# EAGLE design ESP32-Programmer (EAGLE 9.6.2)
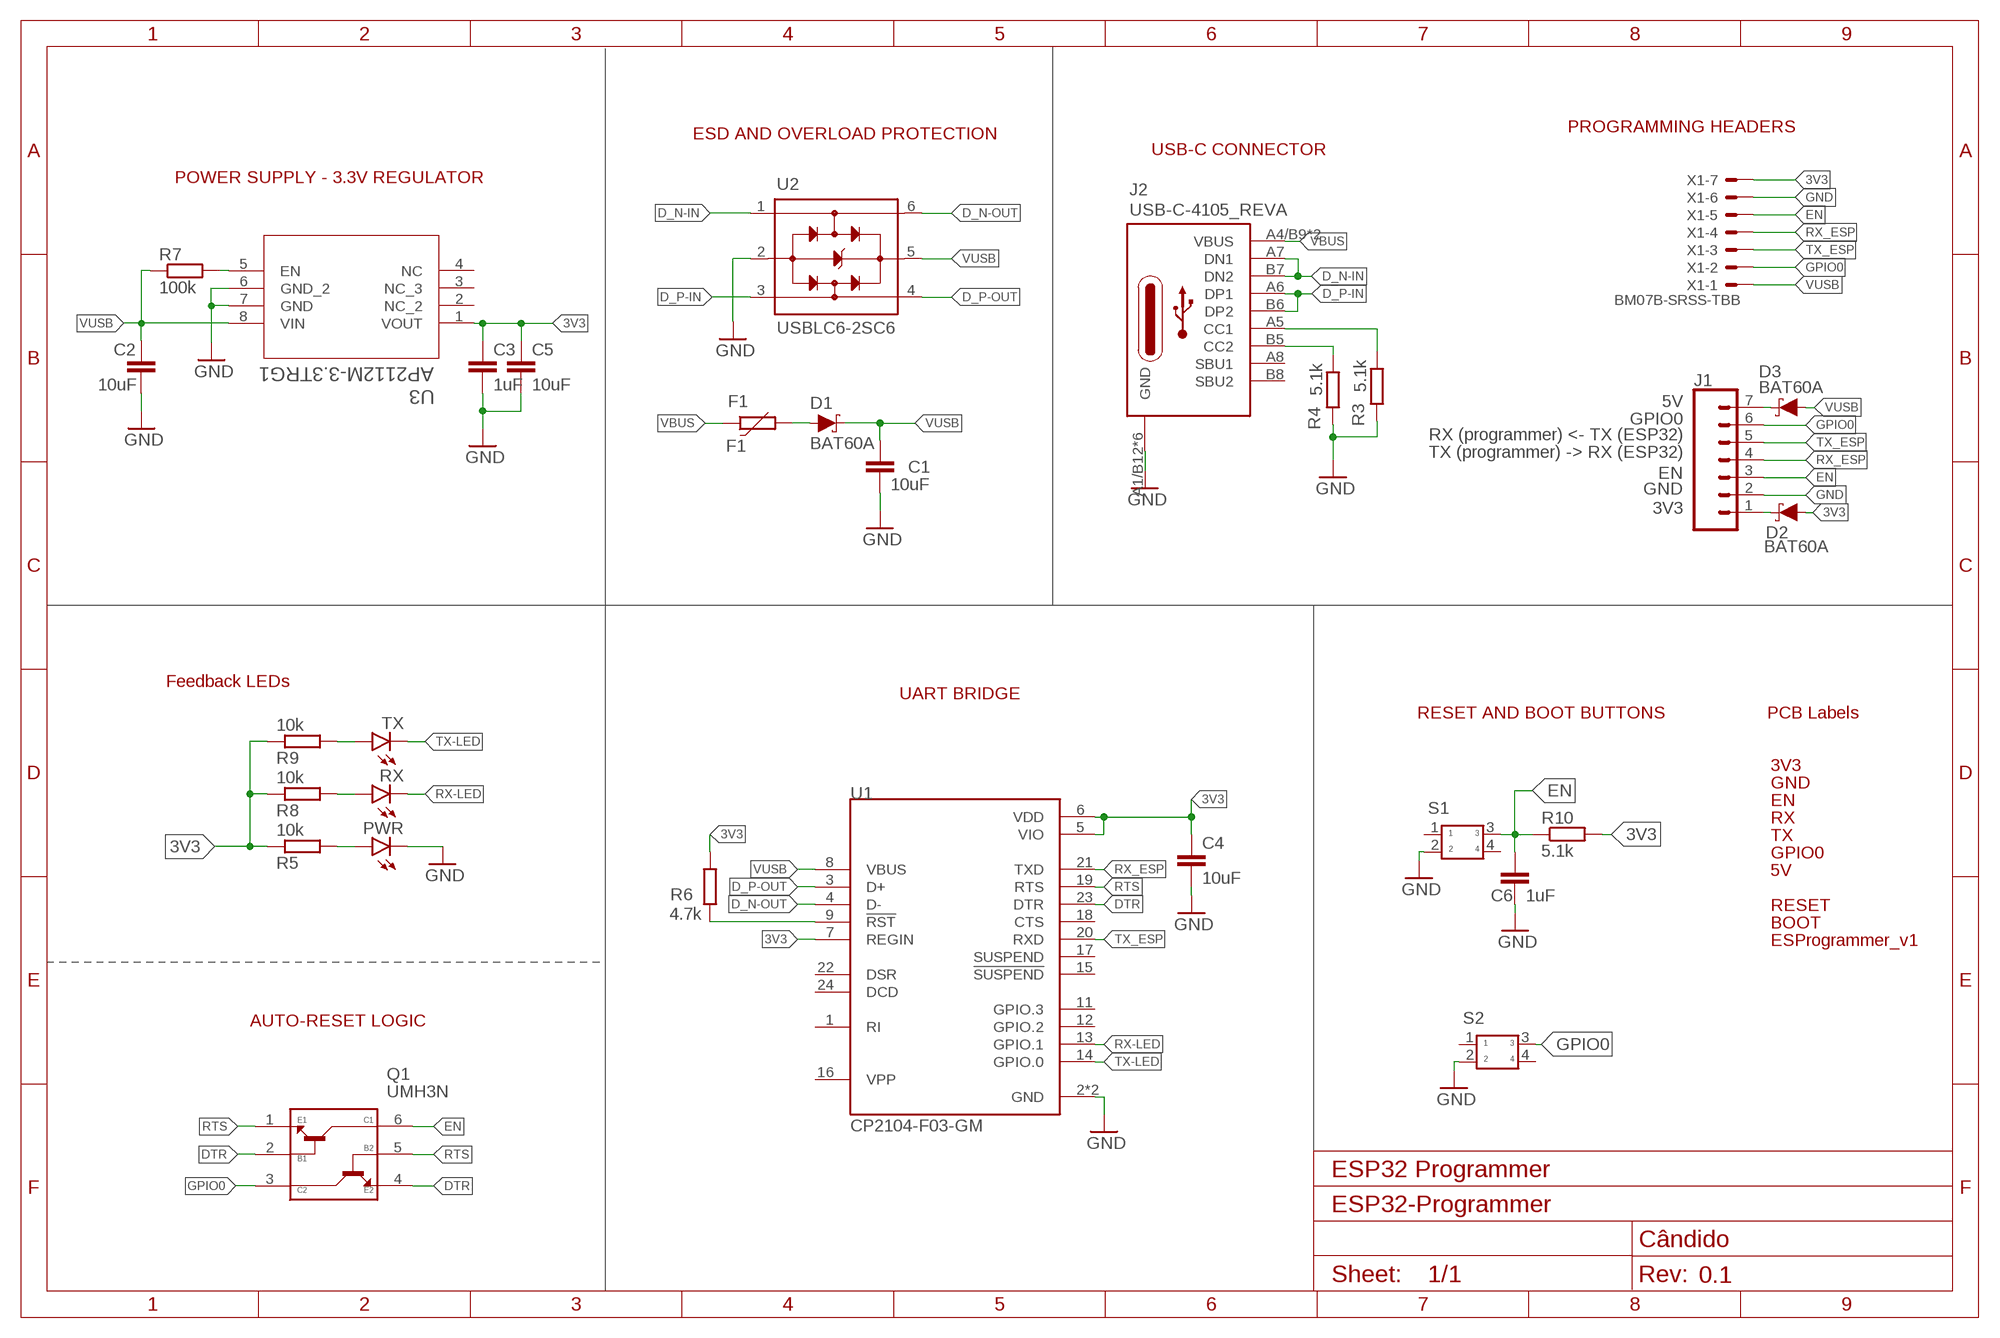
[diagram p0: schematic, sheet 1]

## Parts
C1  10uF  CAPACITOR0603-CAP  [0603-CAP]
C2  10uF  CAPACITOR0603-CAP  [0603-CAP]
C3  1uF  CAPACITOR0603-CAP  [0603-CAP]
C4  10uF  C-EUC0805  [C0805]
C5  10uF  CAPACITOR0603-CAP  [0603-CAP]
C6  1uF  C-EUC0805  [C0805]
D1  BAT60A  DIODE-SCHOTTKY-BAT60A  [SOD-323]
D2  BAT60A  DIODE-SCHOTTKY-BAT60A  [SOD-323]
D3  BAT60A  DIODE-SCHOTTKY-BAT60A  [SOD-323]
F1  F1  PTC-FUSE  [PTC1206]
FRAME1  FRAME_A4  [FRAME-A4]
J1  CONN-07NO_SILK  [1X07_NO_SILK]
J2  USB-C-4105_REVA  [GCT_USB4105_REVA]
PWR  LEDRED-0805  [LED_0805_RED]
Q1  UMH3N  [SOT65P230X110-6N]
R3  5.1k  RESISTOR-EUR0805  [R0805]
R4  5.1k  RESISTOR-EUR0805  [R0805]
R5  10k  RESISTOR-EUR0805  [R0805]
R6  4.7k  RESISTOR-EUR0805  [R0805]
R7  100k  RESISTOR-EUR0805  [R0805]
R8  10k  RESISTOR-EUR0805  [R0805]
R9  10k  RESISTOR-EUR0805  [R0805]
R10  5.1k  RESISTOR-EUR0805  [R0805]
RX  LEDYELLOW-0805  [LED_0805_YELLOW]
S1  KMR621NG_LFS  [KMR621NG_LFS]
S2  KMR621NG_LFS  [KMR621NG_LFS]
TX  LEDORANGE-0805  [LED_0805_ORANGE]
U1  CP2104-F03-GM  [QFN50P400X400X80-25N]
U2  USBLC6-2SC6  [SOT95P280X145-6N]
U3  AP2112M-3.3TRG1  [AP2112M-3.3TRG1_DIO]
U$1  BOOT0  [BOOT0]
U$2  GND0  [GND0]
U$3  3V30  [3V30]
U$4  5V0  [5V0]
U$5  EN0  [EN0]
U$6  GPIO00  [GPIO00]
U$7  RX0  [RX0]
U$8  TX0  [TX0]
U$9  RESET0  [RESET0]
U$12  ESPROGRAMMER_V10  [ESPROGRAMMER_V10]
X1  BM07B-SRSS-TBB  [BM07B-SRSS-TB]

## Nets
3V3: C3.1 C4.1 C5.1 D2.A R5.1 R6.2 R8.1 R9.1 R10.2 U1.5(VIO) U1.6(VDD) U1.7(REGIN) U3.1(VOUT) X1.7
CC1: J2.A5(CC1) R3.1
CC2: J2.B5(CC2) R4.1
D_N-IN: J2.A7(DN1) J2.B7(DN2) U2.1(I/O1_IN)
D_N-OUT: U1.4(D-) U2.6(I/O1_OUT)
D_P-IN: J2.A6(DP1) J2.B6(DP2) U2.3(I/O2_IN)
D_P-OUT: U1.3(D+) U2.4(I/O2_OUT)
DTR: Q1.2(B1) Q1.4(E2) U1.23(DTR)
EN: C6.1 J1.3 Q1.6(C1) R10.1 S1.3 X1.5
GND: C1.2 C2.2 C3.2 C4.2 C5.2 C6.2 J1.2 J2.A1/B12(GND) J2.B1/A12(GND) J2.G1(GND) J2.G2(GND) J2.G3(GND) J2.G4(GND) PWR.C R3.2 R4.2 S1.2 S2.2 U1.2(GND) U1.25(GND) U2.2(GND) U3.6(GND_2) U3.7(GND) X1.6
GPIO0: J1.6 Q1.3(C2) S2.3 X1.2
N$3: R6.1 U1.9(!RST)
N$4: D2.C J1.1
N$5: D3.C J1.7
N$7: PWR.A R5.2
N$8: R7.2 U3.5(EN)
N$10: R8.2 RX.A
N$11: R9.2 TX.A
N$12: D1.A F1.2
RTS: Q1.1(E1) Q1.5(B2) U1.19(RTS)
RX-LED: RX.C U1.13(GPIO.1)
RX_ESP: J1.4 U1.21(TXD) X1.4
TX-LED: TX.C U1.14(GPIO.0)
TX_ESP: J1.5 U1.20(RXD) X1.3
VBUS: F1.1 J2.A4/B9(VBUS) J2.B4/A9(VBUS)
VUSB: C1.1 C2.1 D1.C D3.A R7.1 U1.8(VBUS) U2.5(VBUS) U3.8(VIN) X1.1
Unconnected: J2.A8(SBU1) J2.B8(SBU2) S1.1 S1.4 S2.1 S2.4 U1.1(RI) U1.11(GPIO.3) U1.12(GPIO.2) U1.15(!SUSPEND) U1.16(VPP) U1.17(SUSPEND) U1.18(CTS) U1.22(DSR) U1.24(DCD) U3.2(NC_2) U3.3(NC_3) U3.4(NC)

## Notes on the sheet
- PROGRAMMING HEADERS
- ESD AND OVERLOAD PROTECTION
- USB-C CONNECTOR
- POWER SUPPLY - 3.3V REGULATOR
- 5V
- GPIO0
- RX (programmer) <- TX (ESP32)
- TX (programmer) -> RX (ESP32)
- EN
- GND
- 3V3
- Feedback LEDs
- UART BRIDGE
- RESET AND BOOT BUTTONS | PCB Labels
- AUTO-RESET LOGIC

## Library data of the parts
C1-C3 C5 = Vsoft:CAPACITOR: Capacitor Standard 0603 ceramic capacitor, and 0.1" leaded capacitor.
C4 C6 = Vsoft:C-EU: CAPACITOR, European symbol
D1-D3 = SparkFun-DiscreteSemi:DIODE-SCHOTTKY: Schottky diode A Schottky diode is a semiconductor diode which has a low forward voltage drop and a very fast switching action.; PROD_ID: DIO-14072; VALUE: 3A/10V/280mV
F1 = kailh_cn7:PTC-FUSE
FRAME1 = CN7:FRAME_A4: Frame sized for A4 page with 6mm margin. Places name, datecode and revision mark in bottom copper layer of PCB.; CNAME: ESP32 Programmer; CREVISION: 0.1; DESIGNER: Cândido
J1 = CN7:CONN-07: Multi connection point. Often used as Generic Header-pin footprint for 0.1 inch spaced/style header connections On any of the 0.1 inch spaced packages, you can populate with these: Break Away Headers - Straight <https://www.sparkfun.com/products/116> (PRT-00116) Break Away Male Headers - Right Angle <https://www.sparkfun.com/products/553> (PRT-00553) Female Headers <https://www.sparkfun.com/products/115> (PRT-00115) Break Away Headers - Machine Pin <https://www.sparkfun.com/products/117> (PRT-00117) Break Away Female Headers - Swiss Machine Pin <https://www.sparkfun.com/products/743> (PRT-00743) For SCREWTERMINALS and SPRING TERMINALS visit here: Screw Terimnals on SparkFun.com <https://www.sparkfun.com/search/results?term=Screw+Terminals> (5mm/3.5mm/2.54mm spacing) This device is also useful as a general connection point to wire up your design to another part of your project. Our various solder wires solder well into these plated through hole pads. Hook-Up Wire - Assortment (Stranded, 22 AWG) <https://www.sparkfun.com/products/11375> (PRT-11375) Hook-Up Wire - Assortment (Solid Core, 22 AWG) <https://www.sparkfun.com/products/11367> (PRT-11367) View the entire wire category on our website here <https://www.sparkfun.com/categories/141> Special notes: Molex polarized connector foot print use with SKU : PRT-08231 with associated crimp pins and housings. 1MM SMD Version SKU: PRT-10208 NOTES ON THE VARIANTS LOCK and LOCK_LONGPADS... This footprint was designed to help hold the alignment of a through-hole component (i.e. 6-pin header) while soldering it into place. You may notice that each hole has been shifted either up or down by 0.005 of an inch from it's more standard position (which is a perfectly straight line). This slight alteration caused the pins (the squares in the middle) to touch the edges of the holes. Because they are alternating, it causes a "brace" to hold the component in place. 0.005 has proven to be the perfect amount of "off-center" position when using our standard breakaway headers. Although looks a little odd when you look at the bare footprint, once you have a header in there, the alteration is very hard to notice. Also,if you push a header all the way into place, it is covered up entirely on the bottom side.
J2 = CN7:USB-C-4105_REVA: USB Type C Receptacle for USB 2.0 SMT Type, PCB Top Mount; DESCRIPTION: USB-C (USB TYPE-C) USB 2.0 Receptacle Connector 24 (16+8 Dummy) Position Surface Mount, Right Angle; Through Hole; DIGI-KEY_PART_NUMBER: 2073-USB4105-GF-ACT-ND; MF: Global Connector Technology; MP: USB4105; PACKAGE: Package; PURCHASE-URL: https://pricing.snapeda.com/search/part/USB4105/?ref=eda
PWR RX TX = CN7:LED: LED (Generic) Standard schematic elements and footprints for 5mm, 3mm, 1206, and 0603 sized LEDs. Generic LEDs with no color specified.
Q1 = CN7:UMH3N: 2 NPN pre-biased (Dual) 100mA 50V SC-70-6(SOT-363) Digital Transistors RoHS Source: Datasheet <https://datasheet.lcsc.com/szlcsc/Changjiang-Electronics-Tech-CJ-UMH3N_C62892.pdf> Check availability <https://pricing.snapeda.com/parts/UMH3N/Rohm/view-part?ref=eda>; AVAILABILITY: In Stock; DESCRIPTION: Pre-Biased Bipolar Transistor (BJT) 2 NPN - Pre-Biased (Dual) 50V 100mA 250MHz 150mW Surface Mount UMT6; MF: Rohm; MP: UMH3N; PACKAGE: SOT-363 Rohm; PRICE: None; PURCHASE-URL: https://pricing.snapeda.com/search/part/UMH3N/?ref=eda
R3-R10 = Vsoft:RESISTOR-EU: RESISTOR, European symbol
S1 S2 = CN7:KMR621NG_LFS: IP67 Black Button Tactile Switch, SPST-NO 50 mA 2.11mm Surface Mount Source: Datasheet <http://www.ckswitches.com/media/1907/kmr6.pdf>; ARROW_PART_NUMBER: KMR621NG LFS; DESCRIPTION: IP67 Black Button Tactile Switch, SPST-NO 50 mA 2.11mm Surface Mount; DIGIKEY: CKN10684CT-ND; MANUFACTURER: C & K COMPONENTS; MANUFACTURER_PART_NUMBER: KMR621NG LFS; RS_PART_NUMBER: 1359408
U1 = Vsoft:CP2104-F03-GM: USB-to-UART 1-CH 576byte FIFO 3.3V 24-Pin QFN EP T/R; DESCRIPTION: USB Bridge, USB to UART USB 2.0 UART Interface 24-QFN (4x4); DIGI-KEY_PART_NUMBER: 336-2008-5-ND; MF: Silicon Labs; MP: CP2104-F03-GM; PACKAGE: WFQFN-24 Silicon Labs; PURCHASE-URL: https://pricing.snapeda.com/search/part/CP2104-F03-GM/?ref=eda
U2 = CN7:USBLC6-2SC6: Check availability <https://pricing.snapeda.com/parts/USBLC6-2SC6/STMicroelectronics/view-part?ref=eda> Check availability <https://pricing.snapeda.com/parts/USBLC6-2SC6/STMicroelectronics/view-part?ref=eda>; DESCRIPTION: 17V Clamp 5A (8/20µs) Ipp Tvs Diode Surface Mount SOT-23-6; DIGI-KEY_PART_NUMBER: 497-5235-2-ND; MF: STMicroelectronics; MP: USBLC6-2SC6; PACKAGE: SOT-23-6 STMicroelectronics; PURCHASE-URL: https://pricing.snapeda.com/search/part/USBLC6-2SC6/?ref=eda
U3 = Vsoft:AP2112M-3.3TRG1; COPYRIGHT: Copyright (C) 2022 Ultra Librarian. All rights reserved.; DIGI-KEY_PART_NUMBER_1: AP2112M-3.3TRG1DITR-ND; DIGI-KEY_PART_NUMBER_2: AP2112M-3.3TRG1DICT-ND; DIGI-KEY_PART_NUMBER_3: AP2112M-3.3TRG1DIDKR-ND; MANUFACTURER_PART_NUMBER: AP2112M-3.3TRG1; MFR_NAME: Diodes Inc
U$1 = BOOT-RR:BOOT0
U$2 = gnd-sr:GND0
U$3 = 3V3-sr:3V30
U$4 = 5V-sr:5V0
U$5 = EN-sr:EN0
U$6 = GPIO0-sr:GPIO00
U$7 = RX-sr:RX0
U$8 = TX-SR:TX0
U$9 = RESET-RR:RESET0
U$12 = ESProgrammer:ESPROGRAMMER_V10
X1 = CN7:BM07B-SRSS-TB: Disconnectable Crimp style connector, 1.0mm pitch 7 contacts

## Board
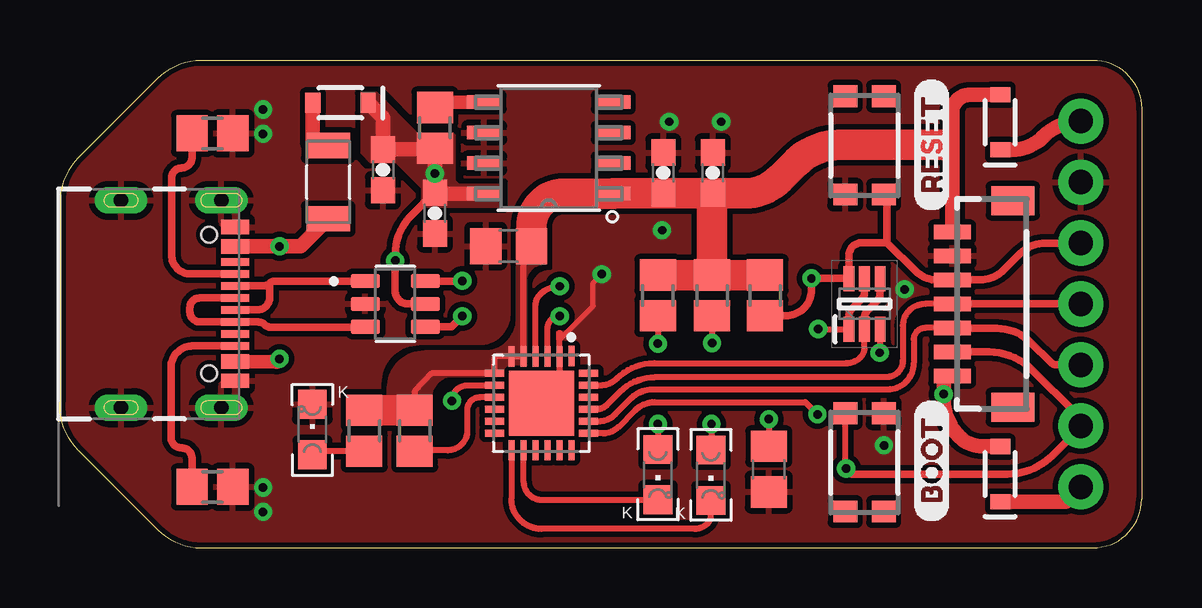
[diagram p1: board, top side]
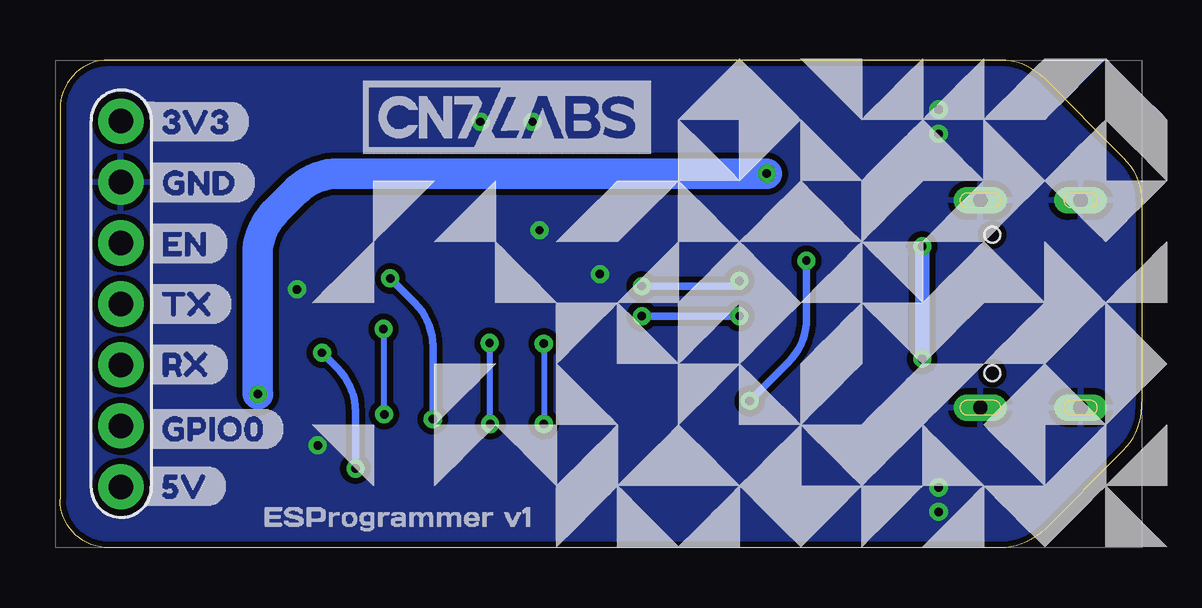
[diagram p2: board, bottom side, seen from below]

Size 45.09 x 20.33 mm. Coordinates in mm from the lower left corner, seen from the top.
Outline: 0.77,16.26 4.07,19.56 arc-49 6.1,20.33 43.06,20.33 arc-90 45.09,18.29 45.09,2.04 arc-90 43.06,0.01 6.1,0.01 arc-49 4.07,0.77 0.77,4.07 arc-49 0.01,6.1 0.01,14.23 arc-49 0.77,16.26
Copper layers (1*16): Top 0.035mm / dielectric 1.5mm / Bottom 0.035mm
Design rules "Vsoft_Hardware *": minimum track width 8mil, minimum drill 18mil, track to track 8mil, track to pad 2mil, pad to pad 2mil, via to via 2mil, smd to smd 2mil, copper to edge 1mil, drill to drill 1mil, minimum pad ring 10mil, minimum via ring 8mil, stop-mask expansion 2mil, vias tented up to drill 20mil, thermal gap 10mil

### Footprints (pad centres in the part's own frame; a part is rotated, then mirrored left to right if it is on the bottom)
0603-CAP = smd 1.1 x 1: 1 -0.85,0; 2 0.85,0
C0805 = smd 1.3 x 1.5: 1 -0.95,0; 2 0.95,0
SOD-323 = smd 0.63 x 0.83: A 1.15,0; C -1.15,0
PTC1206 = smd 1.06 x 1.82: 1 -1.528,0; 2 1.528,0
1X07_NO_SILK = drill 1.016 pad 1.88: 1 0,0; 2 2.54,0; 3 5.08,0; 4 7.62,0; 5 10.16,0; 6 12.7,0; 7 15.24,0
GCT_USB4105_REVA = smd 0.6 x 1.15: A1/B12 -3.2,4.755; A4/B9 -2.4,4.755; B1/A12 3.2,4.755; B4/A9 2.4,4.755 | smd 0.3 x 1.15: A5 -1.25,4.755; A6 -0.25,4.755; A7 0.25,4.755; A8 1.25,4.755; B5 1.75,4.755; B6 0.75,4.755; B7 -0.75,4.755; B8 -1.75,4.755 | drill 0.6 pad 1 long: G1 -4.32,0; G2 4.32,0 | drill 0.6 pad 1.05 long: G3 -4.32,4.18; G4 4.32,4.18 | hole 0.65: 2.89,3.68; -2.89,3.68
LED_0805_RED = smd 1.2 x 1.2: A 0,-1.05; C 0,1.05
SOT65P230X110-6N = smd 1.05 x 0.45: 1 -1.05,0.65; 2 -1.05,0; 3 -1.05,-0.65; 4 1.05,-0.65; 5 1.05,0; 6 1.05,0.65
R0805 = smd 1.3 x 1.5: 1 -0.85,0; 2 0.85,0
LED_0805_YELLOW = smd 1.2 x 1.2: A 0,-1.05; C 0,1.05
KMR621NG_LFS = smd 0.9 x 1: 1 -2.05,-0.8; 2 2.05,-0.8; 3 2.05,0.8; 4 -2.05,0.8
LED_0805_ORANGE = smd 1.2 x 1.2: A 0,-1.05; C 0,1.05
QFN50P400X400X80-25N = smd 0.84 x 0.26: 1 -1.97,1.25 | smd 0.82 x 0.26: 2 -1.955,0.75; 3 -1.955,0.25; 4 -1.955,-0.25; 5 -1.955,-0.75; 6 -1.955,-1.25; 13 1.955,-1.25; 14 1.955,-0.75; 15 1.955,-0.25; 16 1.955,0.25; 17 1.955,0.75; 18 1.955,1.25 | smd 0.26 x 0.82: 7 -1.25,-1.955; 8 -0.75,-1.955; 9 -0.25,-1.955; 10 0.25,-1.955; 11 0.75,-1.955; 12 1.25,-1.955; 19 1.25,1.955; 20 0.75,1.955; 21 0.25,1.955; 22 -0.25,1.955; 23 -0.75,1.955; 24 -1.25,1.955 | smd 2.7 x 2.7: 25 0,0
SOT95P280X145-6N = smd 1.21 x 0.59: 1 -1.255,0.95; 2 -1.255,0; 3 -1.255,-0.95; 4 1.255,-0.95; 5 1.255,0; 6 1.255,0.95
AP2112M-3.3TRG1_DIO = smd 1.422 x 0.559: 1 -2.692,1.905; 2 -2.692,0.635; 3 -2.692,-0.635; 4 -2.692,-1.905; 5 2.692,-1.905; 6 2.692,-0.635; 7 2.692,0.635; 8 2.692,1.905
BM07B-SRSS-TB = smd 0.6 x 1.55: 1 3,-1.625; 2 2,-1.625; 3 1,-1.625; 4 0,-1.625; 5 -1,-1.625; 6 -2,-1.625; 7 -3,-1.625 | smd 1.2 x 1.8: FIT@1 4.3,0.9; FIT@2 -4.3,0.9

### Placement (x,y rotation side)
C1  13.47,15.75 270 top
C2  15.63,13.95 270 top
C3  25.15,15.63 90 top
C4  18.7,12.58 180 top
C5  27.21,15.63 90 top
C6  29.55,3.28 270 top
D1  11.69,18.55 180 top
D2  39.2,17.73 90 top
D3  39.2,3.08 90 top
F1  11.18,15.25 90 top
FRAME1  44.96,0.26 0 top
J1  42.55,17.79 270 top
J2  2.55,10.17 270 top
PWR  10.52,4.93 0 top
Q1  33.53,10.17 90 top
R3  6.36,17.28 0 top
R4  6.36,2.55 0 top
R5  12.68,4.88 270 top
R6  14.79,4.88 90 top
R7  15.63,17.51 90 top
R8  27.18,10.52 270 top
R9  24.92,10.52 270 top
R10  29.39,10.52 90 top
RX  27.13,3.03 180 top
S1  33.53,16.77 270 top
S2  33.53,3.56 90 top
TX  24.92,3.05 180 top
U1  20.07,6.03 270 top
U2  13.98,10.17 0 top
U3  20.38,16.67 180 top
U$1  36.33,1.02 90 top
U$2  41.74,15.22 0 bottom
U$3  41.79,17.76 0 bottom
U$4  41.79,2.57 0 bottom
U$5  41.76,12.68 0 bottom
U$6  41.79,4.96 0 bottom
U$7  41.79,7.65 0 bottom
U$8  41.76,10.17 0 bottom
U$9  36.33,13.98 90 top
U$10  [CN7LABS-1]  32.49,16.41 0 bottom
U$11  [TRUCHET-TILE-1]  34.8,0.03 0 bottom
U$12  37.37,1.35 0 bottom
X1  38.82,10.17 270 top

### Tracks (layer width: path | path; a pad name or v marks a point on that pad's centre or on a via)
3V3
  Top 0.254: R6.2 14.79,6.52 15.49,7.28 U1.7 18.12,7.91 18.19,7.98 | 18.17,7.98 U1.6 U1.5 19.32,12.25 C4.1
  Top 0.61: X1.7 37.19,16.8 | 37.19,16.8 37.19,18.14 arc-90 37.93,18.89 D2.A | 36.86,16.77 37.17,16.77 37.19,16.8
  Top 1.27: 36.86,16.77 36.84,16.8 32.48,16.8 arc45 30.68,16.05 30.03,15.4 arc-45 28.53,14.78 C5.1 | R8.1 R9.1 | R10.2 R8.1 | R8.1 27.18,14.72 arc-45 C5.1 | C5.1 C3.1 23.1,14.78 arc45 U3.1 21,14.76 arc45 20.05,14.37 arc45 19.65,13.4 C4.1 | R5.1 R6.2
  pour Top (no thermals): 15.53,6.3 arc-90 16.36,7.14 18.47,7.14 arc90 18.52,7.19 18.52,7.35 arc-90 18.75,7.57 19.39,7.57 arc90 19.46,7.65 19.46,11.11 arc-90 20.17,11.82 20.22,11.82 arc90 20.3,11.89 20.3,12.63 arc90 20.15,12.78 19.03,12.78 arc90 19,12.76 19,9.53 arc-90 17.68,8.21 15.19,8.21 arc90 13.62,6.64 13.62,6.05 arc90 13.75,5.92 15.42,5.92 arc90 15.53,6.03
CC1
  Top 0.305: J2.A5 5.44,11.42 arc-90 4.65,12.2 4.65,15.42 arc-90 5.06,15.83 arc90 5.51,16.28 R3.1
CC2
  Top 0.305: J2.B5 5.52,8.42 arc90 4.63,7.52 4.63,4.6 arc90 5.06,4.17 arc-90 5.51,3.73 R4.1
D_N-IN
  Top 0.305: J2.B7 8.47,10.92 arc45 8.74,11.03 | 8.74,11.03 arc-45 8.95,11.12 U2.1 | J2.A7 8.21,9.92 arc90 8.74,10.45 8.74,11.03
D_N-OUT  (via drill 0.35)
  Top 0.254: v20.83,10.9 20.82,10.9 arc45 20.02,10.57 arc45 19.82,10.09 U1.4
  Top 0.305: U2.6 16.75,11.12 v16.77,11.13
  Bottom 0.305: v20.83,10.9 17,10.9 v16.77,11.13
D_P-IN
  Top 0.254: 5.84,10.42 5.82,10.42
  Top 0.305: J2.A6 5.84,10.42 | U2.3 12.71,9.2 8.78,9.2 arc-45 8.54,9.3 arc45 8.27,9.42 J2.B6 5.84,9.42 arc-90 5.42,9.84 5.42,10.01 arc-90 5.82,10.42
D_P-OUT  (via drill 0.35)
  Top 0.254: U1.3 20.32,9.15 arc-90 v20.83,9.66
  Top 0.305: U2.4 16.33,9.22 v16.77,9.66
  Bottom 0.305: v20.83,9.66 v16.77,9.66
DTR
  Top 0.254: U1.23 22.51,6.78 arc45 23.22,7.07 23.22,7.06 arc-45 24.76,7.7 32.77,7.7 arc45 33.38,7.96 arc45 33.53,8.32 Q1.2
  Top 0.305: Q1.2 33.53,9.58 arc-45 33.66,9.89 34.04,10.27 arc45 34.18,10.61 Q1.4
EN  (via drill 0.35)
  Top 0.254: v29.55,5.37 C6.1 | 32.87,11.23 Q1.6
  Top 0.305: 34.47,12.74 34.47,12.72 33.43,12.72 arc90 32.88,12.17 Q1.6 | 34.47,12.74 34.47,14.58 S1.3 | J1.3 41.08,12.71 arc45 40.04,12.27 39.35,11.59 arc-45 38.33,11.17 X1.5 36.56,11.17 arc-45 35.67,11.54 34.48,12.73 arc-45 34.47,12.74 | 32.87,11.23 v31.32,11.23 31.32,10.74 arc-45 31.01,9.98 arc-45 30.26,9.67 R10.1
  Bottom 0.305: v29.55,5.37 29.55,8.4 arc-45 30.29,10.2 v31.32,11.23
GND  (via drill 0.35)
  Top 0.203: 20.82,8.67 22.23,10.07 22.23,11.05 v22.59,11.41
  Top 0.254: U1.25 20.07,6.99 20.82,6.99 U1.2 20.82,8.67 20.82,8.95 20.83,8.95
  other vias: 35.21,10.78 34.35,4.27 25.39,17.76 27.56,17.76 8.46,18.27 8.46,17.25 8.46,2.52 8.46,1.5 25.1,13.24
  pour Top (isolate 0.229, rank 2): 45.45,20.71 -0.3,20.71 -0.3,-0.27 45.45,-0.27
  pour Bottom (isolate 0.254): 45.57,20.58 -0.45,20.58 -0.45,-0.43 45.57,-0.43
GPIO0  (via drill 0.35)
  Top 0.254: Q1.3 34.18,8.15 v34.17,8.13 | v32.77,3.31 32.73,3.35 S2.3
  Top 0.305: X1.2 38.72,8.17 arc-45 40.52,7.42 42.33,5.61 arc-45 J1.6 arc-45 42.51,5 41.38,3.87 arc-45 39.48,3.08 33,3.08 v32.77,3.31
  Bottom 0.305: v32.77,3.31 32.77,5.68 arc-45 33.52,7.48 v34.17,8.13
N$3
  Top 0.254: U1.9 17.5,6.28 arc90 16.97,5.75 16.97,4.88 arc-90 16.16,4.07 14.83,4.07 arc90 R6.1
N$4
  Top 0.61: D2.C 39.67,16.59 arc45 40.98,17.13 40.99,17.14 arc-45 J1.1
N$5
  Top 0.61: D3.C 41.93,1.93 J1.7
N$7
  Top 0.254: R5.2 10.64,4.03 PWR.A
N$8
  Top 0.559: U3.5 15.74,18.57 R7.2
N$10  (via drill 0.35)
  Top 0.254: R8.2 v27.18,8.54 | v27.16,5.16 27.16,4.1 RX.A
  Bottom 0.254: v27.18,8.54 27.18,5.19 v27.16,5.16
N$11  (via drill 0.35)
  Top 0.254: R9.2 v24.92,8.51 | v24.92,5.16 TX.A
  Bottom 0.254: v24.92,8.51 v24.92,5.16
N$12
  Top 0.61: F1.2 10.67,16.77 10.54,16.91 D1.A
RTS  (via drill 0.35)
  Top 0.254: v31.58,5.57 31.07,6.08 24.8,6.08 arc45 23.97,5.74 23.27,5.04 arc-45 22.65,4.78 U1.19 | v31.6,9.12 v31.61,9.12 Q1.1
  Top 0.305: Q1.1 32.88,9.67 arc-45 33.01,9.97 33.44,10.4 arc45 33.53,10.63 Q1.5
  Bottom 0.254: v31.58,5.57 31.58,9.12 v31.6,9.12
RX-LED
  Top 0.254: U1.13 18.82,2.04 arc90 20.07,0.79 26.45,0.79 arc45 26.99,1.02 arc45 27.13,1.35 RX.C
RX_ESP
  Top 0.254: X1.4 36.07,10.17 arc45 35.39,9.88 arc45 35.13,9.27 35.13,7.8 arc-90 34.45,7.12 24.8,7.12 arc45 23.36,6.52 22.83,5.99 arc-45 22.32,5.78 U1.21
  Top 0.305: J1.4 X1.4
TX-LED
  Top 0.254: U1.14 19.32,2.77 arc90 20.09,2 TX.C
TX_ESP
  Top 0.254: X1.3 36.06,9.17 arc90 35.59,8.69 35.59,7.69 arc-90 34.51,6.61 24.69,6.61 arc45 23.83,6.25 23.14,5.57 arc-45 22.44,5.28 U1.20
  Top 0.305: J1.5 41.55,7.63 arc-45 41.31,7.73 40.48,8.56 arc45 39.05,9.15 37.23,9.15 arc-45 X1.3
VBUS  (via drill 0.35)
  Top 0.559: J2.B4/A9 9.04,7.77
  Top 0.61: J2.A4/B9 v9.15,12.57 10.03,12.57 F1.1 | 9.04,7.77 v9.15,7.88
  Bottom 0.61: v9.15,7.88 v9.15,12.57
VUSB  (via drill 0.35)
  Top 0.254: v16.34,6.13 arc-90 16.99,6.78 U1.8
  Top 0.305: 15.63,14.79 C2.1 15.58,14.8 14.67,13.89 arc45 13.98,12.22 v13.98,11.97 13.98,10.7 arc90 14.51,10.17 U2.5
  Top 0.61: D1.C 13.47,17.92 C1.1 15.58,16.6 R7.1 v15.63,15.6 C2.1 15.66,14.76 U3.8 | X1.1 36.84,7.17 v36.84,6.41 36.84,6.22 arc45 37.5,4.63 arc45 38.46,4.23 D3.A
  Bottom 0.305: v13.98,11.97 13.98,9.54 arc45 14.72,7.75 v16.34,6.13
  Bottom 1.27: v36.84,6.41 36.86,6.43 36.86,12.21 arc45 36.12,14.01 35.27,14.86 arc45 33.47,15.6 v15.63,15.6
  pour Top (no thermals): 12.53,18.98 12.53,16.46 12.93,16.06 14,16.06 15.04,15.02 15.04,14.46 15.3,14.2 18.37,14.2 18.45,14.28 18.45,15.07 18.37,15.14 16.64,15.14 16.49,15.3 16.49,17.2 16.41,17.28 14.92,17.28 13.21,18.98